# EAGLE design Atmex 1.3 (EAGLE 6.6.0)
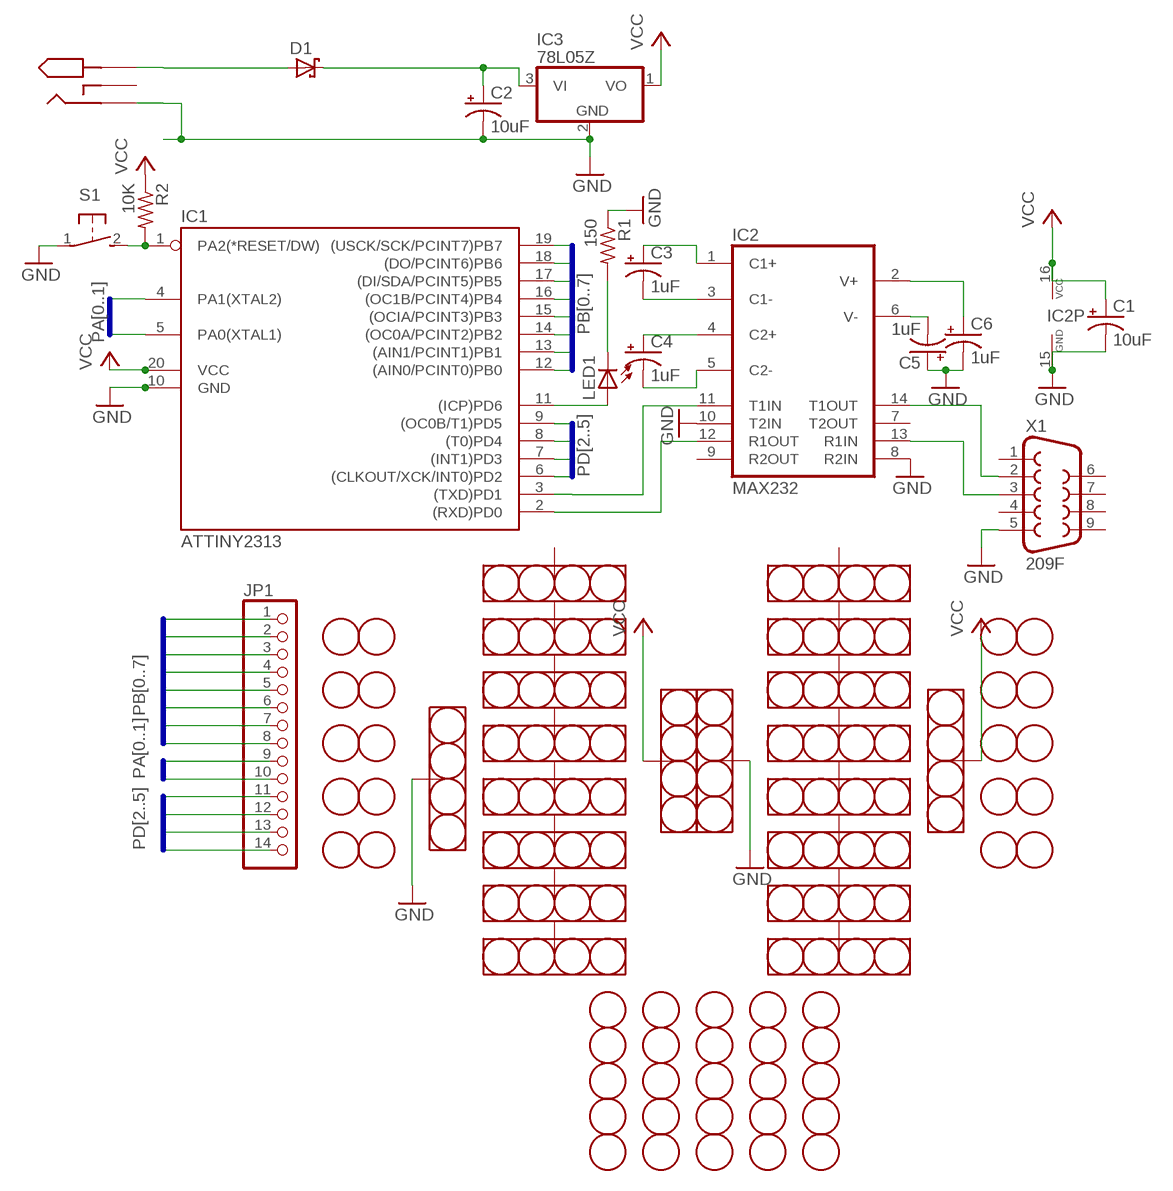
[diagram p0: schematic, sheet 1]

## Parts
C1  10uF  CPOL-USE2-5  [E2-5]
C2  10uF  CPOL-USE2-5  [E2-5]
C3  1uF  CPOL-USE1.8-4  [E1,8-4]
C4  1uF  CPOL-USE1.8-4  [E1,8-4]
C5  1uF  CPOL-USE1.8-4  [E1,8-4]
C6  1uF  CPOL-USE1.8-4  [E1,8-4]
D1  SCHOTTKY-DIODEDO35-7  [DO35-7]
IC1  ATTINY2313  [DIL20]
IC2  MAX232  [DIL16]
IC3  78L05Z  [TO92]
JP1  PINHD-1X14  [1X14]
LED1  LED5MM  [LED5MM]
R1  150  R-US_0204/7  [0204/7]
R2  10K  R-US_0204/7  [0204/7]
S1  31-XX  [B3F-31XX]
U$1  2.1MMJACK  [PJ-102A]
U$2  PROTOAREAPROTO3  PROTOAREA3  [PROTO_3]
U$3  PROTOAREAPROTO3  PROTOAREA3  [PROTO_3]
U$4  PROTOAREAPROTO3  PROTOAREA3  [PROTO_3]
U$5  PROTOAREAPROTO3  PROTOAREA3  [PROTO_3]
U$6  PROTOAREAPROTO3  PROTOAREA3  [PROTO_3]
U$7  PROTOAREAPROTO3  PROTOAREA3  [PROTO_3]
U$8  PROTOAREAPROTO3  PROTOAREA3  [PROTO_3]
U$9  PROTOAREAPROTO3  PROTOAREA3  [PROTO_3]
U$10  PROTOAREAPROTO3  PROTOAREA3  [PROTO_3]
U$11  PROTOAREAPROTO3  PROTOAREA3  [PROTO_3]
U$12  HEADER12  [HEADER_12]
U$13  HEADER12  [HEADER_12]
U$14  PROTOAREAPROTO3  PROTOAREA3  [PROTO_3]
U$15  PROTOAREAPROTO3  PROTOAREA3  [PROTO_3]
U$16  PROTOAREA  PROTOAREA12  [PROTO_12]
U$17  PROTOAREA  PROTOAREA12  [PROTO_12]
U$18  PROTOAREAPROTO3  PROTOAREA3  [PROTO_3]
U$19  PROTOAREAPROTO3  PROTOAREA3  [PROTO_3]
U$21  PROTOAREAPROTO8  PROTOAREA8  [PROTO_8]
U$22  PROTOAREAPROTO8  PROTOAREA8  [PROTO_8]
U$23  PROTOAREAPROTO3  PROTOAREA3  [PROTO_3]
U$24  PROTOAREAPROTO3  PROTOAREA3  [PROTO_3]
U$25  HEADER12  [HEADER_12]
U$26  HEADER12  [HEADER_12]
U$27  HEADER14  [HEADER_14]
U$28  HEADER8  [HEADER_8]
U$29  HEADER8  [HEADER_8]
U$30  HEADER8  [HEADER_8]
U$31  HEADER8  [HEADER_8]
X1  209F  F09D  [F09D]

## Nets
GND: C1.- C2.- C5.+ C6.- IC1.10(GND) IC2.8(R2IN) IC2.10(T2IN) IC2.15(GND) IC3.2(GND) R1.1 S1.1(P) U$1.R U$16.P$1 U$22.P$1 X1.5
N$1: C3.- IC2.3(C1-)
N$2: C3.+ IC2.1(C1+)
N$3: C4.+ IC2.4(C2+)
N$4: C4.- IC2.5(C2-)
N$5: IC1.1(PA2(*RESET/DW)) R2.2 S1.2(S)
N$6: C2.+ D1.C IC3.3(VI)
N$7: C5.- IC2.6(V-)
N$8: IC2.13(R1IN) X1.3
N$9: C6.+ IC2.2(V+)
N$10: IC2.14(T1OUT) X1.2
N$11: IC1.11((ICP)PD6) LED1.A
N$12: LED1.K(C) R1.2
N$13: D1.A U$1.T
PA0: IC1.5(PA0(XTAL1)) JP1.9
PA1: IC1.4(PA1(XTAL2)) JP1.10
PB0: IC1.12((AIN0/PCINT0)PB0) JP1.1
PB1: IC1.13((AIN1/PCINT1)PB1) JP1.2
PB2: IC1.14((OC0A/PCINT2)PB2) JP1.3
PB3: IC1.15((OCIA/PCINT3)PB3) JP1.4
PB4: IC1.16((OC1B/PCINT4)PB4) JP1.5
PB5: IC1.17((DI/SDA/PCINT5)PB5) JP1.6
PB6: IC1.18((DO/PCINT6)PB6) JP1.7
PB7: IC1.19((USCK/SCK/PCINT7)PB7) JP1.8
PD0: IC1.2((RXD)PD0) IC2.12(R1OUT)
PD1: IC1.3((TXD)PD1) IC2.11(T1IN)
PD2: IC1.6((CLKOUT/XCK/INT0)PD2) JP1.11
PD3: IC1.7((INT1)PD3) JP1.12
PD4: IC1.8((T0)PD4) JP1.13
PD5: IC1.9((OC0B/T1)PD5) JP1.14
VCC: C1.+ IC1.20(VCC) IC2.16(VCC) IC3.1(VO) R2.1 U$17.P$1 U$21.P$1
Unconnected: IC2.7(T2OUT) IC2.9(R2OUT) U$1.T_S U$2.P$1 U$3.P$1 U$4.P$1 U$5.P$1 U$6.P$1 U$7.P$1 U$8.P$1 U$9.P$1 U$10.P$1 U$11.P$1 U$14.P$1 U$15.P$1 U$18.P$1 U$19.P$1 U$23.P$1 U$24.P$1 X1.1 X1.4 X1.6 X1.7 X1.8 X1.9

## Buses
PB[0..7]
PD[2..5]
PA[0..1]

## Library data of the parts
C1-C6 = rcl:CPOL-US: POLARIZED CAPACITOR, American symbol
D1 = diode:SCHOTTKY-DIODE: Schottky Diode
IC1 = atmex:ATTINY2313
IC2 = maxim:MAX232: RS232 TRANSCEIVER; MF: MAXIM; MPN: MAX232ACPE+; OC_FARNELL: 9723773; OC_NEWARK: 68K4544
IC3 = linear:78*: Positive VOLTAGE REGULATOR Source: http://cache.national.com/ds/LM/LM78L05.pdf http://www.fairchildsemi.com/ds/LM/LM7805.pdf
JP1 = pinhead:PINHD-1X14: PIN HEADER
LED1 = led:LED: LED OSRAM: - CHIPLED LG R971, LG N971, LY N971, LG Q971, LY Q971, LO R971, LY R971 LH N974, LH R974 LS Q976, LO Q976, LY Q976 LO Q996 - Hyper CHIPLED LW Q18S LB Q993, LB Q99A, LB R99A - SideLED LS A670, LO A670, LY A670, LG A670, LP A670 LB A673, LV A673, LT A673, LW A673 LH A674 LY A675 LS A676, LA A676, LO A676, LY A676, LW A676 LS A679, LY A679, LG A679 - Hyper Micro SIDELED® LS Y876, LA Y876, LO Y876, LY Y876 LT Y87S - SmartLED LW L88C, LW L88S LB L89C, LB L89S, LG L890 LS L89K, LO L89K, LY L89K LS L896, LA L896, LO L896, LY L896 - TOPLED LS T670, LO T670, LY T670, LG T670, LP T670 LSG T670, LSP T670, LSY T670, LOP T670, LYG T670 LG T671, LOG T671, LSG T671 LB T673, LV T673, LT T673, LW T673 LH T674 LS T676, LA T676, LO T676, LY T676, LB T676, LH T676, LSB T676, LW T676 LB T67C, LV T67C, LT T67C, LS T67K, LO T67K, LY T67K, LW E67C LS E67B, LA E67B, LO E67B, LY E67B, LB E67C, LV E67C, LT E67C LW T67C LS T679, LY T679, LG T679 LS T770, LO T770, LY T770, LG T770, LP T770 LB T773, LV T773, LT T773, LW T773 LH T774 LS E675, LA E675, LY E675, LS T675 LS T776, LA T776, LO T776, LY T776, LB T776 LHGB T686 LT T68C, LB T68C - Hyper Mini TOPLED® LB M676 - Mini TOPLED Santana® LG M470 LS M47K, LO M47K, LY M47K Source: http://www.osram.convergy.de LUXEON: - LUMILED® LXK2-PW12-R00, LXK2-PW12-S00, LXK2-PW14-U00, LXK2-PW14-V00 LXK2-PM12-R00, LXK2-PM12-S00, LXK2-PM14-U00 LXK2-PE12-Q00, LXK2-PE12-R00, LXK2-PE12-S00, LXK2-PE14-T00, LXK2-PE14-U00 LXK2-PB12-K00, LXK2-PB12-L00, LXK2-PB12-M00, LXK2-PB14-N00, LXK2-PB14-P00, LXK2-PB14-Q00 LXK2-PR12-L00, LXK2-PR12-M00, LXK2-PR14-Q00, LXK2-PR14-R00 LXK2-PD12-Q00, LXK2-PD12-R00, LXK2-PD12-S00 LXK2-PH12-R00, LXK2-PH12-S00 LXK2-PL12-P00, LXK2-PL12-Q00, LXK2-PL12-R00 Source: www.luxeon.com KINGBRIGHT: KA-3528ASYC Source: www.kingbright.com
R1 R2 = rcl:R-US_: RESISTOR, American symbol
S1 = switch-omron:31-XX: OMRON SWITCH; MPN: B3F-3100; OC_FARNELL: 959704; OC_NEWARK: 36M3582
U$1 = atmex:2.1MMJACK
U$2-U$11 U$14-U$19 U$21-U$24 = atmex:PROTOAREA
U$12 U$13 U$25-U$31 = atmex:HEADER
X1 = con-subd:F09: SUB-D; OC_FARNELL: unknown; OC_NEWARK: unknown

## Board
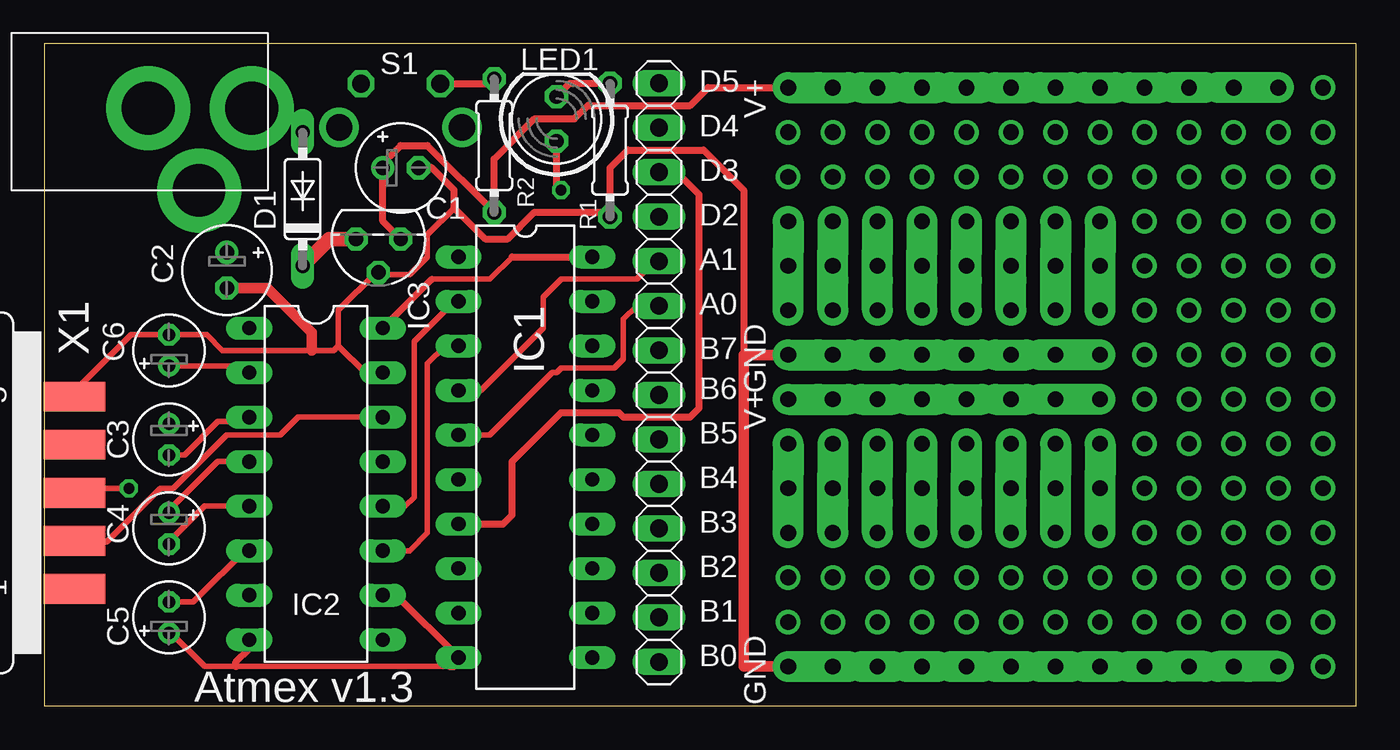
[diagram p1: board, top side]
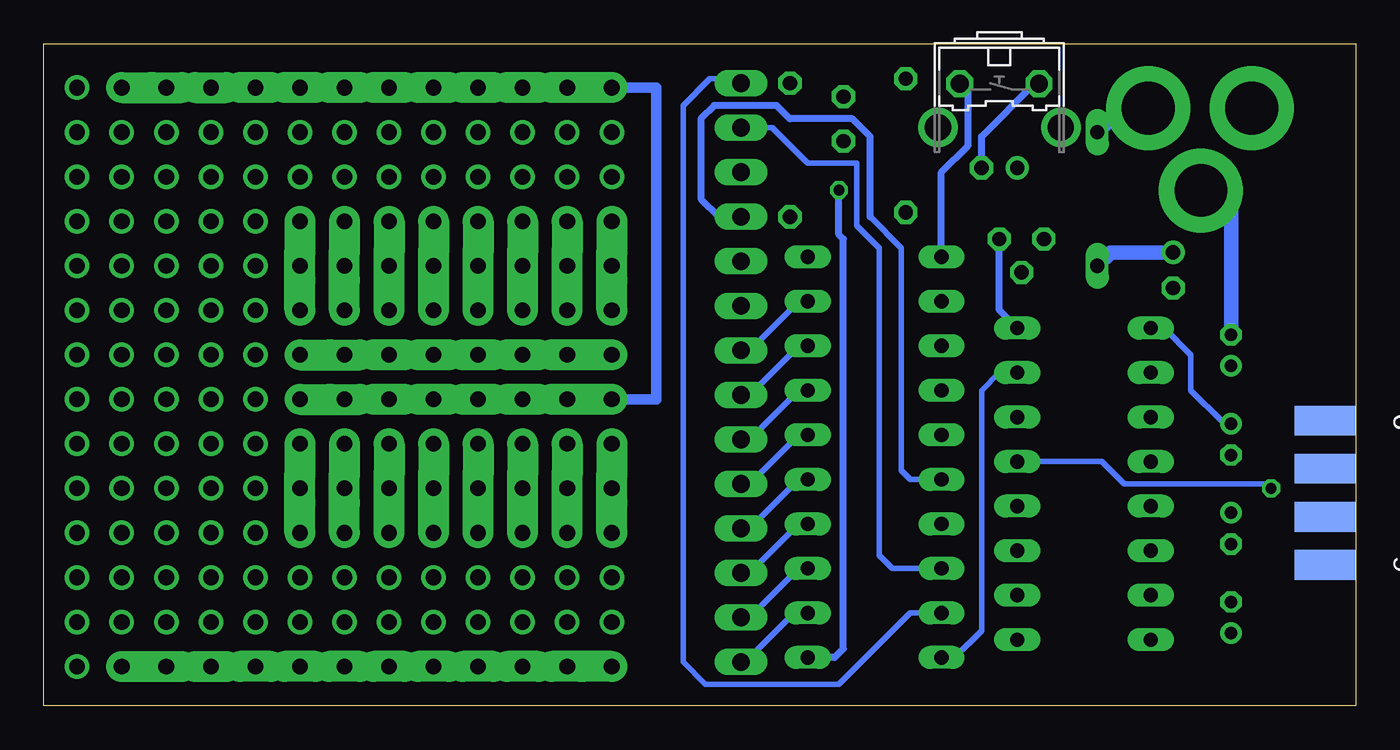
[diagram p2: board, bottom side, seen from below]

Size 74.8 x 37.77 mm. Coordinates in mm from the lower left corner, seen from the top.
Outline: 0,37.77 0,0 74.8,0 74.8,37.77 0,37.77
Copper layers (1*16): Top 0.035mm / dielectric 1.5mm / Bottom 0.035mm
Design rules "default *": minimum track width 10mil, minimum drill 24mil, track to track 8mil, track to pad 8mil, pad to pad 8mil, via to via 8mil, smd to smd 8mil, copper to edge 15mil, drill to drill 8mil, minimum pad ring 10mil, minimum via ring 8mil, stop-mask expansion 4mil, vias tented up to drill 0mil, thermal gap 10mil

### Footprints (pad centres in the part's own frame; a part is rotated, then mirrored left to right if it is on the bottom)
E2-5 = drill 0.813 pad 1.27: + -1.016,0 | drill 0.813 pad 1.27 octagon: - 1.016,0
E1,8-4 = drill 0.711 pad 1.168: + -0.889,0 | drill 0.711 pad 1.168 octagon: - 0.889,0
DO35-7 = drill 0.813 long: A 3.81,0; C -3.81,0
DIL20 = drill 0.813 long: 1 -11.43,-3.81; 2 -8.89,-3.81; 3 -6.35,-3.81; 4 -3.81,-3.81; 5 -1.27,-3.81; 6 1.27,-3.81; 7 3.81,-3.81; 8 6.35,-3.81; 9 8.89,-3.81; 10 11.43,-3.81; 11 11.43,3.81; 12 8.89,3.81; 13 6.35,3.81; 14 3.81,3.81; 15 1.27,3.81; 16 -1.27,3.81; 17 -3.81,3.81; 18 -6.35,3.81; 19 -8.89,3.81; 20 -11.43,3.81
DIL16 = drill 0.813 long: 1 -8.89,-3.81; 2 -6.35,-3.81; 3 -3.81,-3.81; 4 -1.27,-3.81; 5 1.27,-3.81; 6 3.81,-3.81; 7 6.35,-3.81; 8 8.89,-3.81; 9 8.89,3.81; 10 6.35,3.81; 11 3.81,3.81; 12 1.27,3.81; 13 -1.27,3.81; 14 -3.81,3.81; 15 -6.35,3.81; 16 -8.89,3.81
TO92 = drill 0.813 octagon: 1 -1.27,0; 2 0,1.905; 3 1.27,0
1X14 = drill 1.016 long: 1 -16.51,0; 2 -13.97,0; 3 -11.43,0; 4 -8.89,0; 5 -6.35,0; 6 -3.81,0; 7 -1.27,0; 8 1.27,0; 9 3.81,0; 10 6.35,0; 11 8.89,0; 12 11.43,0; 13 13.97,0; 14 16.51,0
LED5MM = drill 0.813 octagon: A -1.27,0; K 1.27,0
0204/7 = drill 0.813 octagon: 1 -3.81,0; 2 3.81,0
B3F-31XX = drill 1.016 octagon: 1 -2.261,-1.245; 2 2.261,-1.245 | drill 1.499 pad 2.159: 3 -3.505,1.245; 4 3.505,1.245
PJ-102A = drill 3 pad 4.8: R -4.6,-6.29; T 0.1,-9.29; T_S 0.1,-3.39
PROTO_3 = drill 0.889 pad 1.778 offset: P$1 -2.54,0; P$3 2.54,0 | drill 0.889 pad 1.778 long: P$2 0,0
HEADER_12 = drill 0.889: P$1 2.54,0; P$2 0,0; P$3 -2.54,0; P$4 -5.08,0; P$5 -7.62,0; P$6 -10.16,0; P$7 5.08,0; P$8 7.62,0; P$9 10.16,0; P$10 12.7,0; P$13 -12.7,0; P$14 15.24,0
PROTO_12 = drill 0.889 pad 1.778 offset: P$1 -15.24,0; P$7 12.7,0 | drill 0.889 pad 1.778 long: P$2 0,0; P$3 -2.54,0; P$5 -5.08,0; P$6 5.08,0; P$8 7.62,0; P$9 -7.62,0; P$10 -10.16,0; P$11 -12.7,0; P$12 10.16,0; P$14 2.54,0
PROTO_8 = drill 0.889 pad 1.778 offset: P$1 -8.89,0; P$7 8.89,0 | drill 0.889 pad 1.778 long: P$2 -1.27,0; P$3 -3.81,0; P$5 -6.35,0; P$6 3.81,0; P$8 6.35,0; P$9 1.27,0
HEADER_14 = drill 0.889: P$1 0,0; P$2 -2.54,0; P$3 -5.08,0; P$4 -7.62,0; P$5 -10.16,0; P$6 -12.7,0; P$7 2.54,0; P$8 5.08,0; P$9 7.62,0; P$10 10.16,0; P$11 12.7,0; P$12 15.24,0; P$13 -15.24,0; P$14 17.78,0
HEADER_8 = drill 0.889: P$1 2.54,0; P$2 0,0; P$3 -2.54,0; P$4 -5.08,0; P$5 -7.62,0; P$6 -10.16,0; P$7 5.08,0; P$8 7.62,0
F09D = smd 1.7 x 3.5: 1 -5.486,-6.045; 2 -2.743,-6.045; 3 0,-6.045; 4 2.743,-6.045; 5 5.486,-6.045 | smd 1.7 x 3.5 bottom: 6 -4.115,-6.045; 7 -1.372,-6.045; 8 1.372,-6.045; 9 4.115,-6.045

### Placement (x,y rotation side)
C1  20.32,30.7 0 top
C2  10.41,24.85 270 top
C3  7.11,15.2 270 top
C4  7.11,10.12 270 top
C5  7.11,5.04 90 top
C6  7.11,20.28 90 top
D1  14.73,28.92 90 top
IC1  27.43,14.19 270 top
IC2  15.49,12.66 270 top
IC3  19.05,26.63 180 top
JP1  35.05,19.01 90 top
LED1  29.21,33.49 90 top
R1  32.26,31.71 90 top
R2  25.65,31.97 90 top
S1  20.32,34.25 180 bottom
U$1  2.54,34 90 top
U$2  50.04,12.41 90 bottom
U$3  44.96,25.11 90 bottom
U$4  42.42,25.11 90 bottom
U$5  42.42,12.41 90 bottom
U$6  44.96,12.41 90 bottom
U$7  47.5,12.41 90 bottom
U$8  52.58,12.41 90 bottom
U$9  55.12,12.41 90 bottom
U$10  57.66,12.41 90 bottom
U$11  60.2,12.41 90 bottom
U$12  62.74,17.49 90 bottom
U$13  65.28,17.49 90 bottom
U$14  47.5,25.11 90 bottom
U$15  50.04,25.11 90 bottom
U$16  57.66,2.25 180 bottom
U$17  57.66,35.27 180 bottom
U$18  52.58,25.11 90 bottom
U$19  55.12,25.11 90 bottom
U$21  51.31,17.49 180 bottom
U$22  51.31,20.03 180 bottom
U$23  57.66,25.11 90 bottom
U$24  60.2,25.11 90 bottom
U$25  67.82,17.49 90 bottom
U$26  70.36,17.49 90 bottom
U$27  72.9,17.49 90 bottom
U$28  52.58,4.79 180 bottom
U$29  52.58,7.33 180 bottom
U$30  52.58,30.19 180 bottom
U$31  52.58,32.73 180 bottom
X1  -4.32,12.15 90 top

### Tracks (layer width: path | path; a pad name or v marks a point on that pad's centre or on a via)
GND
  Top 0.305: IC2.15 18.29,19.01 16.76,20.54 | IC3.2 19.05,24.85 18.92,24.73 | 16.76,20.54 16.76,22.57 18.92,24.73 | 23.37,28.41 21.84,26.89 21.84,25.62 20.83,24.6 19.05,24.6 18.92,24.73 | 16.76,20.54 16.51,20.28 15.24,20.28 10.16,20.28 9.27,21.17 C6.- 4.95,21.17 1.52,17.74 1.63,17.64 X1.5 | 23.11,2.25 10.92,2.25 9.14,2.25 7.11,4.28 C5.+
  Top 0.406: C1.- 22.1,30.7 23.37,29.43 23.37,28.41 25.15,26.63 26.42,26.63 27.94,28.16 32.26,28.16 R1.1 32.26,30.7 33.27,31.71 37.59,31.71 39.88,29.43 39.88,20.03 | 10.92,2.25 10.92,2.5 11.68,3.26 IC2.8 | IC2.10 20.07,6.31 IC1.10 23.62,2.5 23.37,2.25 23.11,2.25
  Top 0.61: U$22.P$1 39.88,20.03 39.88,2.25 U$16.P$1 | S1.1 18.06,35.52 | C2.- 12.7,23.84 15.24,21.3 15.24,20.28
  Bottom 0.305: IC2.15 20.32,19.01 21.34,18 21.34,4.28 22.86,2.76
  Bottom 0.406: C1.- 21.34,32.47 18.29,35.52 18.03,35.52 S1.1 | IC1.10 22.86,2.76
  Bottom 0.813: U$1.R 7.11,29.4 C6.-
N$1
  Top 0.305: C3.- 8,14.31 9.91,16.22 11.43,16.22 IC2.3
N$2
  Bottom 0.305: IC2.1 10.92,21.55 9.4,20.03 9.4,18 7.62,16.22 C3.+
N$3
  Top 0.305: IC2.4 9.91,13.93 7.11,11.14 C4.+
N$4
  Top 0.305: C4.- 7.11,9.36 9.14,11.39 IC2.5
N$5
  Top 0.305: S1.2 22.84,35.5 22.86,35.52 23.88,35.52
  Top 0.406: S1.2 25.38,35.5 R2.2
  Bottom 0.406: IC1.1 23.62,30.44 22.1,31.97 22.1,35.01 S1.2 22.61,35.52
N$6
  Top 0.406: IC3.3 17.78,26.38 17.53,26.63
  Top 0.813: 17.53,26.63 16.26,26.63 D1.C
  Bottom 0.305: IC3.3 17.78,27.14
  Bottom 0.813: C2.+ 13.97,25.87 D1.C
N$7
  Top 0.305: IC2.6 11.68,9.11 8.51,5.93 C5.-
N$8  (via drill 0.61)
  Top 0.305: X1.3 1.73,12.36 1.78,12.41 v4.83,12.41
  Bottom 0.305: IC2.13 14.48,13.93 13.21,12.66 5.08,12.66 v4.83,12.41
N$9
  Top 0.305: C6.+ 11.3,19.39 IC2.2
N$10
  Top 0.305: IC2.14 14.48,16.47 13.46,15.46 10.41,15.46 7.37,12.41 6.6,12.41 3.56,9.36 1.78,9.36 X1.2 | X1.2
N$11  (via drill 0.61)
  Top 0.406: LED1.A 29.21,29.43 v29.46,29.43
  Bottom 0.406: v29.46,29.43 29.46,26.89 29.21,26.63 29.21,3.26 29.72,2.76 IC1.11
N$12
  Top 0.406: R1.2 29.97,35.52 LED1.K
N$13
  Bottom 0.813: U$1.T 13.31,34.1 D1.A
PA0
  Top 0.305: IC1.5 25.4,15.46 28.96,19.01 29.21,19.01 29.46,19.27 32.51,19.27 33.02,19.77 33.02,22.06 33.78,22.82 JP1.9
PA1
  Top 0.305: IC1.4 24.89,18 28.45,21.55 28.45,23.33 29.46,24.35 33.78,24.35 34.8,25.36 JP1.10
PB0
  Bottom 0.305: JP1.1 34.8,2.5 32,5.3 IC1.12
PB1
  Bottom 0.305: JP1.2 34.54,5.04 31.75,7.84 IC1.13
PB2
  Bottom 0.305: JP1.3 34.54,7.58 31.75,10.38 IC1.14
PB3
  Bottom 0.305: JP1.4 34.54,10.12 31.75,12.92 IC1.15
PB4
  Bottom 0.305: JP1.5 34.8,12.41 31.75,15.46 IC1.16
PB5
  Bottom 0.305: JP1.6 34.8,14.95 31.75,18 IC1.17
PB6
  Bottom 0.305: JP1.7 34.54,17.74 31.75,20.54 IC1.18
PB7
  Bottom 0.305: IC1.19 31.75,23.08 34.29,20.54 34.8,20.54 JP1.8
PD0
  Top 0.305: IC1.2 23.37,23.08 21.08,20.79 21.08,11.9 20.57,11.39 IC2.12
PD1
  Top 0.305: IC1.3 22.86,20.54 21.84,19.52 21.84,9.87 20.83,8.85 IC2.11
PD2
  Bottom 0.305: IC1.6 25.4,12.92 25.91,13.42 25.91,26.12 27.69,27.9
  Bottom 0.406: 27.69,27.9 27.69,32.47 28.7,33.49 32.26,33.49 33.02,34.25 36.58,34.25 37.34,33.49 37.34,28.92 36.32,27.9 JP1.11
PD3
  Top 0.406: IC1.7 26.16,10.38 26.67,10.88 26.67,13.93 29.46,16.73 32.77,16.73 33.02,16.47 36.83,16.47 37.34,16.98 37.34,29.17 36.07,30.44 JP1.12
PD4
  Bottom 0.305: IC1.8 26.42,7.84 27.18,8.6 27.18,26.12 28.45,27.39 28.45,30.95 31.24,30.95 33.27,32.98 JP1.13
PD5
  Bottom 0.305: IC1.9 25.4,5.3 29.46,1.23 37.08,1.23 38.35,2.5 38.35,34.25 36.83,35.78 35.31,35.78 JP1.14
VCC
  Top 0.305: 26.67,25.62 25.4,24.35 22.1,24.35
  Top 0.406: IC3.1 19.3,27.65 C1.+ 19.05,30.7 20.32,31.97 21.84,31.97 R2.1 25.65,31.2 27.94,33.49 30.23,33.49 30.99,34.25 36.83,34.25 37.85,35.27 U$17.P$1 | IC2.16 22.1,24.35 | 26.67,25.62 IC1.20
  Bottom 0.406: IC3.1 20.32,22.57 IC2.16
  Bottom 0.61: U$17.P$1 39.88,35.27 39.88,17.49 U$21.P$1

### Text on the board
tNames: V+ | D5 | D4 | D3 | D2 | A1 | A0 | GND | B7 | B6 | V+ | B5 | B4 | B3 | B2 | B1 | GND | B0 | Atmex v1.3